# Altium schematic sheet LVDS.SchDoc
size 594 x 420 mm; SheetNumber: 9; SheetTotal: 13
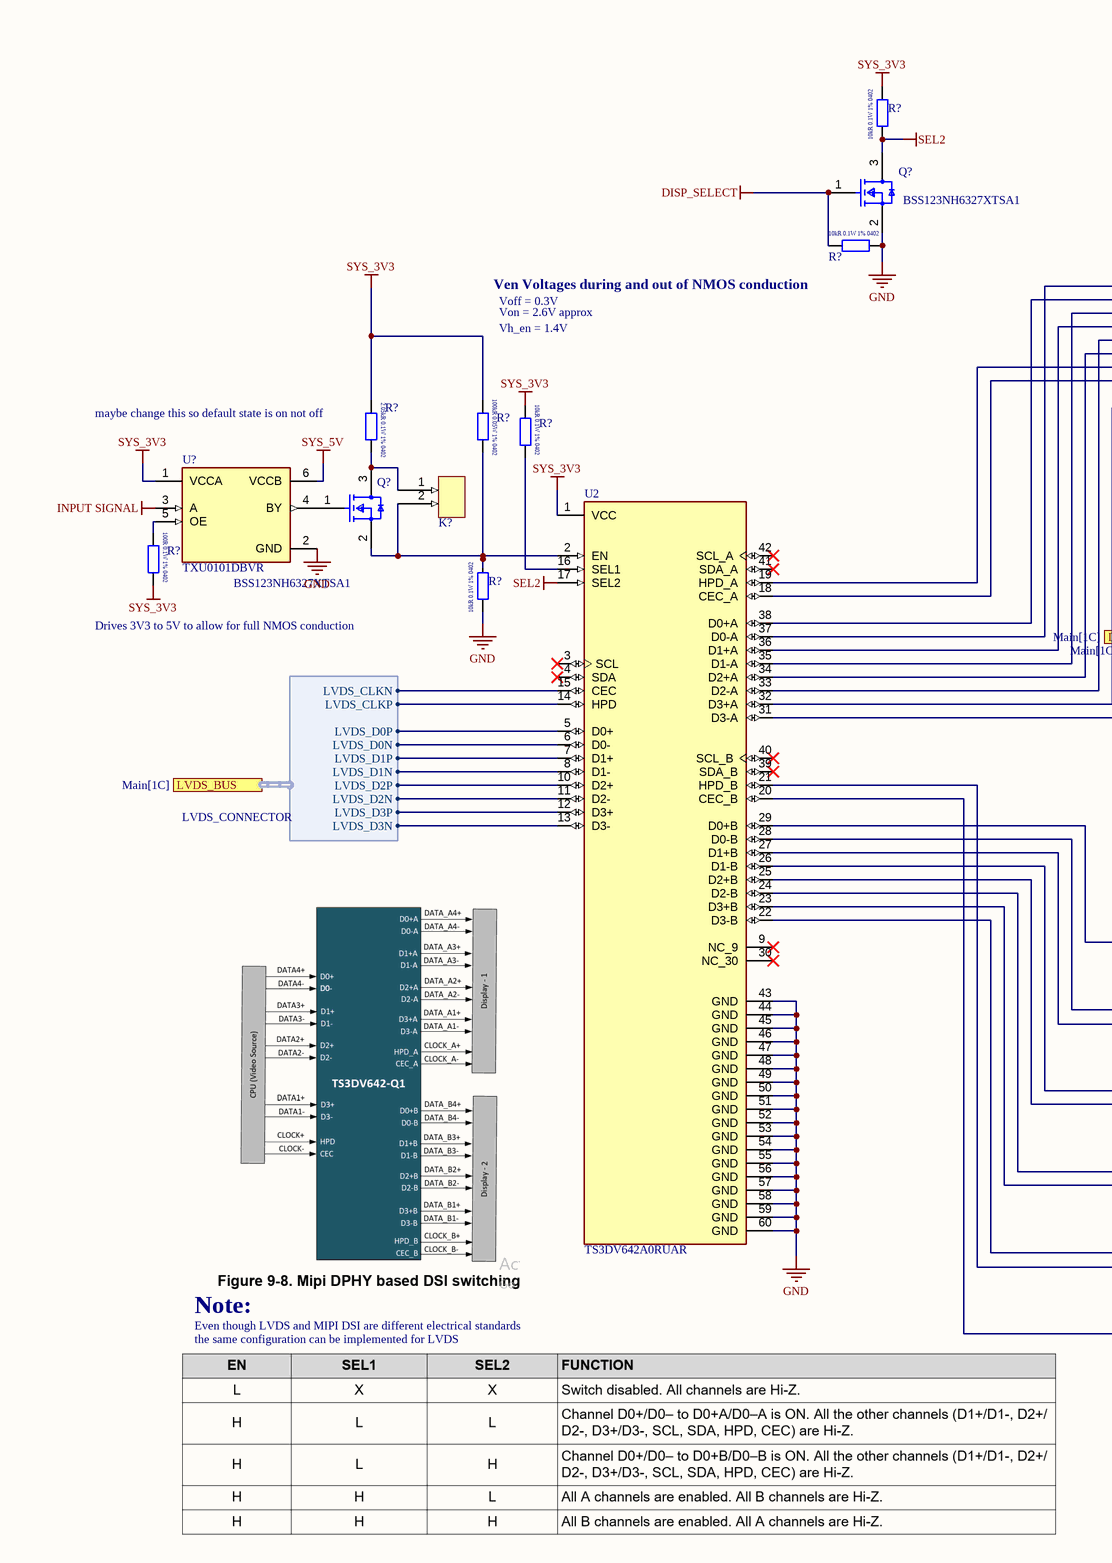
[diagram p0: LVDS.SchDoc, top left]
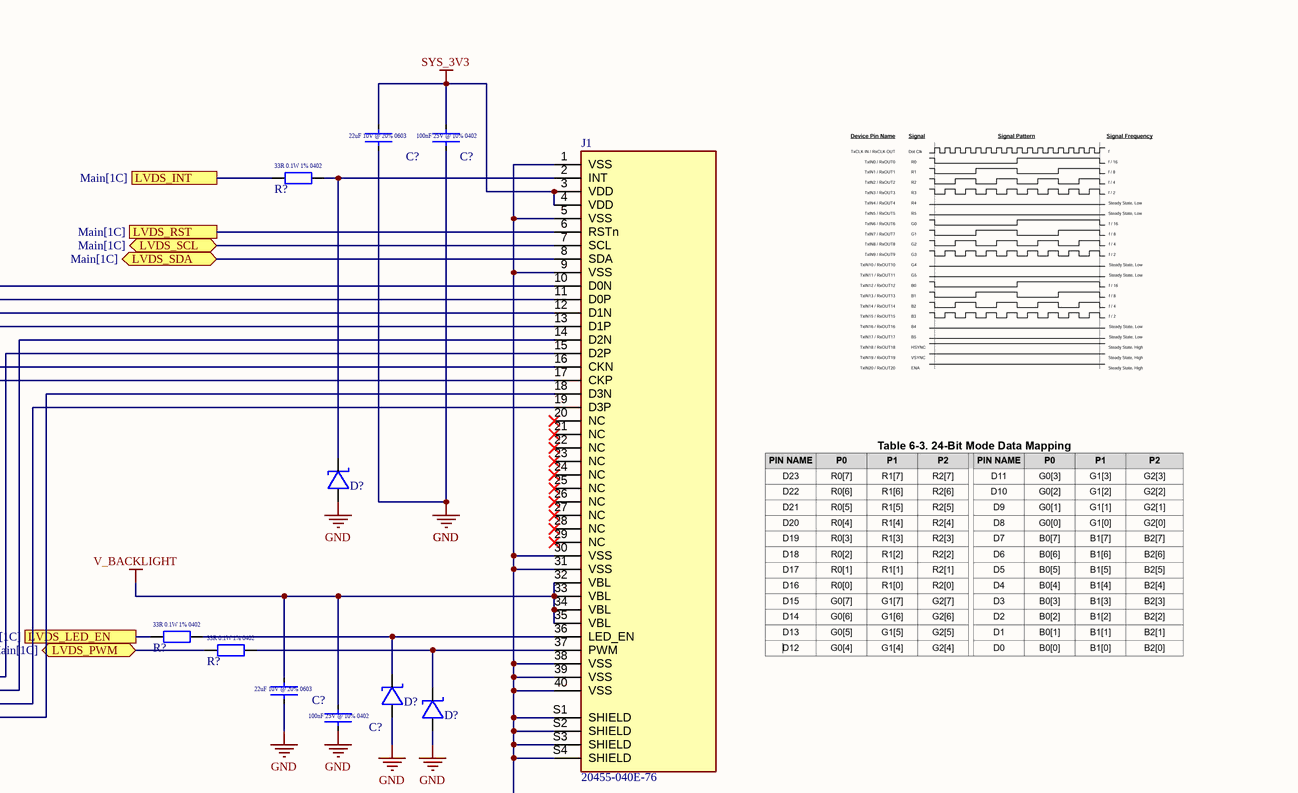
[diagram p1: LVDS.SchDoc, top right]
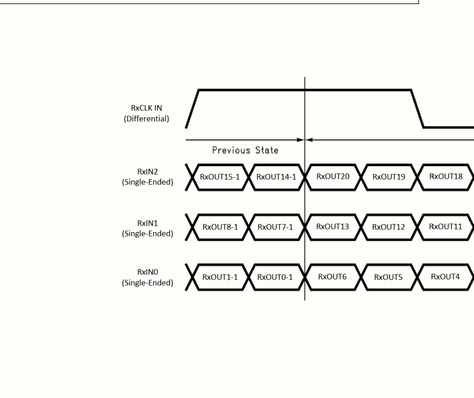
[diagram p2: LVDS.SchDoc, bottom left]
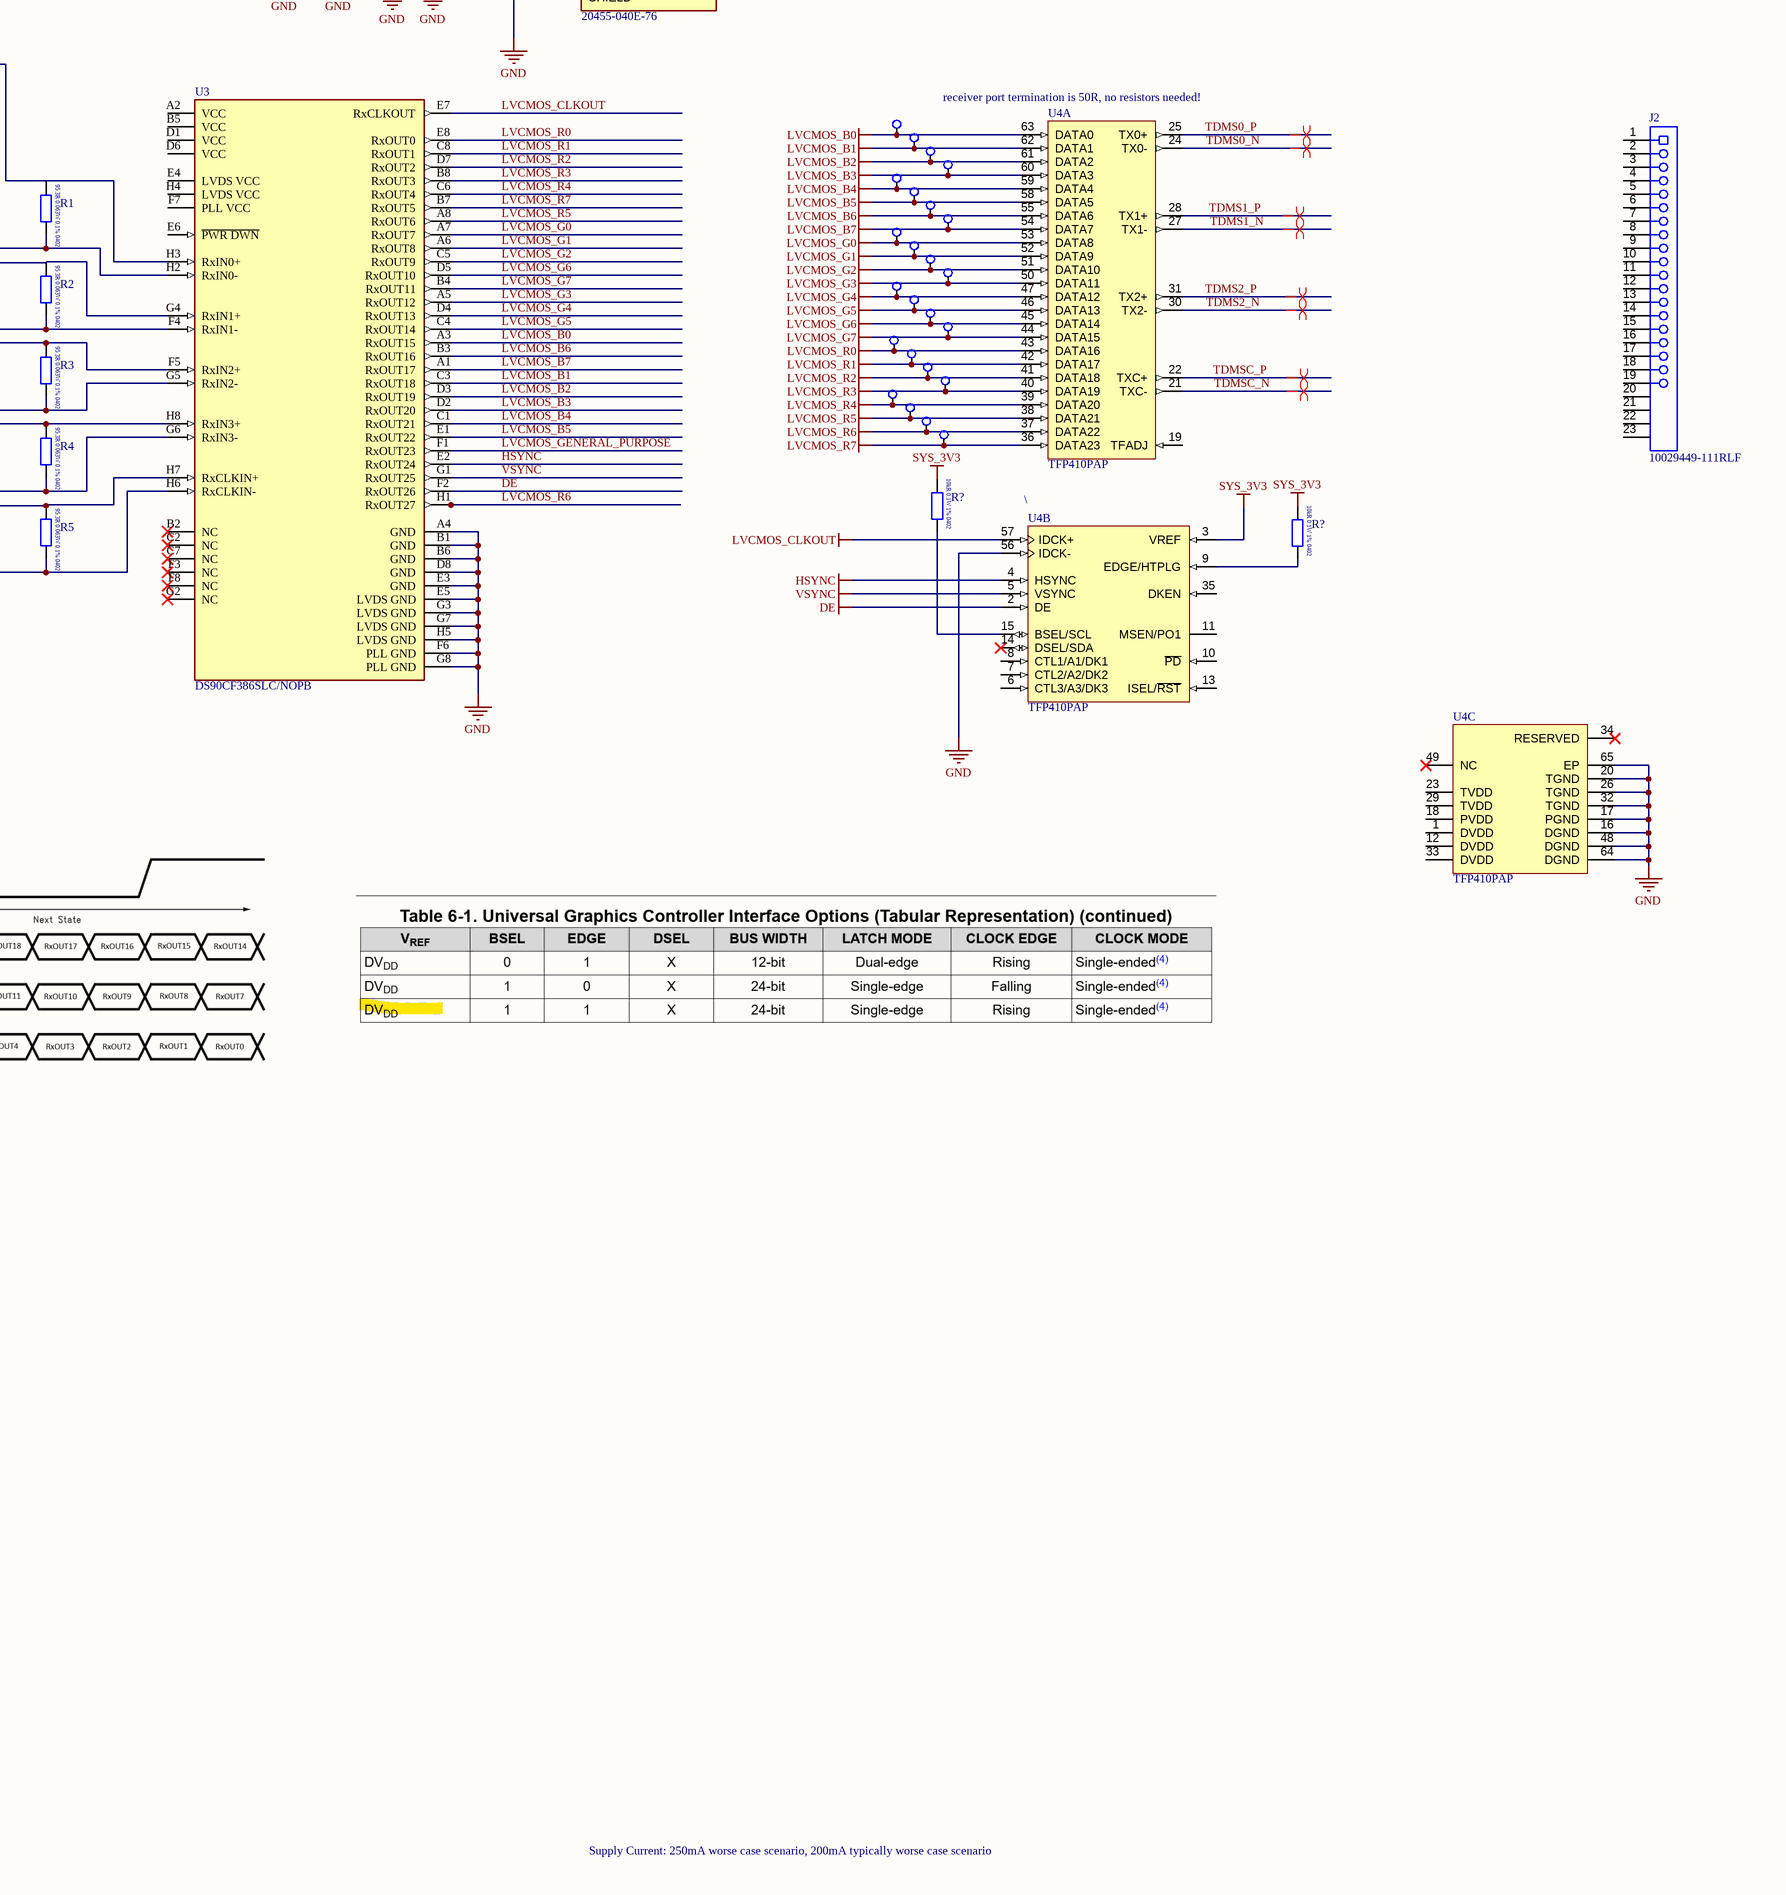
[diagram p3: LVDS.SchDoc, bottom right]

## Parts
(Parts that share a designator on the sheet are numbered #1, #2 ... from top to bottom, then left to right.)
C?#1  CL10A226MP8NUNE  [CAPC1608X09N]  (value not drawn)
C?#2  CL05A104KA5NNNC  [CAPC1005X06N]  (value not drawn)
C?#3  CL10A226MP8NUNE  [CAPC1608X09N]  (value not drawn)
C?#4  CL05A104KA5NNNC  [CAPC1005X06N]  (value not drawn)
D?#1  ESD5581N2T5G  [DIODFN100X60X40-2N]  (value not drawn)
D?#2  ESD5581N2T5G  [DIODFN100X60X40-2N]  (value not drawn)
D?#3  ESD5581N2T5G  [DIODFN100X60X40-2N]  (value not drawn)
J1  20455-040E-76  [IPEX_20455-040E-76]
J2  10029449-111RLF  [FCI-10029449-111RLF_V]
K?  TSW-102-07-F-S  [SAMTEC_TSW-102-07-F-S]  (value not drawn)
Q?#1  BSS123NH6327XTSA1  [FP-PG-SOT23-3-MFG]
Q?#2  BSS123NH6327XTSA1  [FP-PG-SOT23-3-MFG]
R1  ERA-2AEB95R3X  [RESC1005X04L]  (value not drawn)
R2  ERA-2AEB95R3X  [RESC1005X04L]  (value not drawn)
R3  ERA-2AEB95R3X  [RESC1005X04L]  (value not drawn)
R4  ERA-2AEB95R3X  [RESC1005X04L]  (value not drawn)
R5  ERA-2AEB95R3X  [RESC1005X04L]  (value not drawn)
R?#1  RK73H1ETTP1002F  [RESC1005X04N]  (value not drawn)
R?#2  ERJ-2RKF33R0X  [RESC1005X04L]  (value not drawn)
R?#3  RK73H1ETTP1002F  [RESC1005X04N]  (value not drawn)
R?#4  RK73H1ETTP2051F  [RESC1005X04N]  (value not drawn)
R?#5  RK73H1ETTP1003F  [RESC1005X04N]  (value not drawn)
R?#6  RK73H1ETTP1002F  [RESC1005X04N]  (value not drawn)
R?#7  ERJ-2RKF1000X  [RESC1005X04L]  (value not drawn)
R?#8  RK73H1ETTP1002F  [RESC1005X04N]  (value not drawn)
R?#9  ERJ-2RKF33R0X  [RESC1005X04L]  (value not drawn)
R?#10  ERJ-2RKF33R0X  [RESC1005X04L]  (value not drawn)
R?#11  RK73H1ETTP1002F  [RESC1005X04N]  (value not drawn)
R?#12  RK73H1ETTP1002F  [RESC1005X04N]  (value not drawn)
TP  Test Point  [Test Point]  (value not drawn)
TP?#1  Test Point  [Test Point]  (value not drawn)
TP?#2  Test Point  [Test Point]  (value not drawn)
TP?#3  Test Point  [Test Point]  (value not drawn)
TP?#4  Test Point  [Test Point]  (value not drawn)
TP?#5  Test Point  [Test Point]  (value not drawn)
TP?#6  Test Point  [Test Point]  (value not drawn)
TP?#7  Test Point  [Test Point]  (value not drawn)
TP?#8  Test Point  [Test Point]  (value not drawn)
TP?#9  Test Point  [Test Point]  (value not drawn)
TP?#10  Test Point  [Test Point]  (value not drawn)
TP?#11  Test Point  [Test Point]  (value not drawn)
TP?#12  Test Point  [Test Point]  (value not drawn)
TP?#13  Test Point  [Test Point]  (value not drawn)
TP?#14  Test Point  [Test Point]  (value not drawn)
TP?#15  Test Point  [Test Point]  (value not drawn)
TP?#16  Test Point  [Test Point]  (value not drawn)
TP?#17  Test Point  [Test Point]  (value not drawn)
TP?#18  Test Point  [Test Point]  (value not drawn)
TP?#19  Test Point  [Test Point]  (value not drawn)
TP?#20  Test Point  [Test Point]  (value not drawn)
TP?#21  Test Point  [Test Point]  (value not drawn)
TP?#22  Test Point  [Test Point]  (value not drawn)
TP?#23  Test Point  [Test Point]  (value not drawn)
U2  TS3DV642A0RUAR  [QFN50P900X350X80-43N]
U3  DS90CF386SLC/NOPB  [FP-NZC0064A-MFG]
U4  TFP410PAP  [PAP0064D_L]  (parts A,B,C of 3)
U?  TXU0101DBVR  [IC_TXU0101DBVR]

## Ports
LVDS_BUS (harness LVDS_CONNECTOR, see Main[1C]), LVDS_INT (see Main[1C]), LVDS_LED_EN (see Main[1C]), LVDS_PWM (bidir, see Main[1C]), LVDS_RST (see Main[1C]), LVDS_SCL (bidir, see Main[1C]), LVDS_SDA (bidir, see Main[1C])

## Harnesses
LVDS_CONNECTOR: LVDS_D0N, LVDS_D0P, LVDS_D1N, LVDS_D1P, LVDS_D2N, LVDS_D2P, LVDS_CLKN, LVDS_CLKP, LVDS_D3N, LVDS_D3P

## Nets
DE: U3.F2(RxOUT26) U4.2(DE)
DISP_SELECT: Q?#1.1(G) R?#3.1
GND: C?#1.1 C?#2.1 C?#3.1 C?#4.1 D?#1.1 D?#2.1 D?#3.1 J1.1(VSS) J1.5(VSS) J1.9(VSS) J1.30(VSS) J1.31(VSS) J1.38(VSS) J1.39(VSS) J1.40(VSS) J1.S1(SHIELD) J1.S2(SHIELD) J1.S3(SHIELD) J1.S4(SHIELD) Q?#1.2(S) R?#3.2 R?#8.1 U2.43(GND) U2.44(GND) U2.45(GND) U2.46(GND) U2.47(GND) U2.48(GND) U2.49(GND) U2.50(GND) U2.51(GND) U2.52(GND) U2.53(GND) U2.54(GND) U2.55(GND) U2.56(GND) U2.57(GND) U2.58(GND) U2.59(GND) U2.60(GND) U3.A4(GND) U3.B1(GND) U3.B6(GND) U3.D8(GND) U3.E3(GND) U3.E5(LVDS_GND) U3.F6(PLL_GND) U3.G3(LVDS_GND) U3.G7(LVDS_GND) U3.G8(PLL_GND) U3.H5(LVDS_GND) U4.16(DGND) U4.17(PGND) U4.20(TGND) U4.26(TGND) U4.32(TGND) U4.48(DGND) U4.56(IDCK-) U4.64(DGND) U4.65(EP) U?.2(GND)
HSYNC: U3.E2(RxOUT24) U4.4(HSYNC)
INPUT SIGNAL: U?.3(A)
LVCMOS_B0: TP.12 U3.A3(RxOUT15) U4.63(DATA0)
LVCMOS_B1: TP?#1.12 U3.C3(RxOUT18) U4.62(DATA1)
LVCMOS_B2: TP?#2.12 U3.D3(RxOUT19) U4.61(DATA2)
LVCMOS_B3: TP?#3.12 U3.D2(RxOUT20) U4.60(DATA3)
LVCMOS_B4: TP?#4.12 U3.C1(RxOUT21) U4.59(DATA4)
LVCMOS_B5: TP?#5.12 U3.E1(RxOUT22) U4.58(DATA5)
LVCMOS_B6: TP?#6.12 U3.B3(RxOUT16) U4.55(DATA6)
LVCMOS_B7: TP?#7.12 U3.A1(RxOUT17) U4.54(DATA7)
LVCMOS_CLKOUT: U3.E7(RxCLKOUT) U4.57(IDCK+)
LVCMOS_G0: TP?#8.12 U3.A7(RxOUT7) U4.53(DATA8)
LVCMOS_G1: TP?#9.12 U3.A6(RxOUT8) U4.52(DATA9)
LVCMOS_G2: TP?#10.12 U3.C5(RxOUT9) U4.51(DATA10)
LVCMOS_G3: TP?#11.12 U3.A5(RxOUT12) U4.50(DATA11)
LVCMOS_G4: TP?#12.12 U3.D4(RxOUT13) U4.47(DATA12)
LVCMOS_G5: TP?#13.12 U3.C4(RxOUT14) U4.46(DATA13)
LVCMOS_G6: TP?#14.12 U3.D5(RxOUT10) U4.45(DATA14)
LVCMOS_G7: TP?#15.12 U3.B4(RxOUT11) U4.44(DATA15)
LVCMOS_R0: TP?#16.12 U3.E8(RxOUT0) U4.43(DATA16)
LVCMOS_R1: TP?#17.12 U3.C8(RxOUT1) U4.42(DATA17)
LVCMOS_R2: TP?#18.12 U3.D7(RxOUT2) U4.41(DATA18)
LVCMOS_R3: TP?#19.12 U3.B8(RxOUT3) U4.40(DATA19)
LVCMOS_R4: TP?#20.12 U3.C6(RxOUT4) U4.39(DATA20)
LVCMOS_R5: TP?#21.12 U3.A8(RxOUT6) U4.38(DATA21)
LVCMOS_R6: TP?#22.12 U3.H1(RxOUT27) U4.37(DATA22)
LVCMOS_R7: TP?#23.12 U3.B7(RxOUT5) U4.36(DATA23)
SEL2: Q?#1.3(D) R?#1.1 U2.17(SEL2)
SYS_3V3: C?#1.2 C?#2.2 J1.3(VDD) J1.4(VDD) R?#1.2 R?#4.1 R?#5.1 R?#6.1 R?#7.2 R?#11.1 R?#12.1 U2.1(VCC) U4.3(VREF) U?.1(VCCA)
SYS_5V: U?.6(VCCB)
V_BACKLIGHT: C?#3.2 C?#4.2 J1.32(VBL) J1.33(VBL) J1.34(VBL) J1.35(VBL)
VSYNC: U3.G1(RxOUT25) U4.5(VSYNC)
LVCMOS_GENERAL_PURPOSE: U3.F1(RxOUT23)
LVDS_INT: R?#2.1 ; port LVDS_INT
LVDS_LED_EN: R?#9.1 ; port LVDS_LED_EN
LVDS_PWM: R?#10.1 ; port LVDS_PWM
LVDS_RST: J1.6(RSTn) ; port LVDS_RST
LVDS_SCL: J1.7(SCL) ; port LVDS_SCL
LVDS_SDA: J1.8(SDA) ; port LVDS_SDA
TDMS0_N: U4.24(TX0-)
TDMS0_P: U4.25(TX0+)
TDMS1_N: U4.27(TX1-)
TDMS1_P: U4.28(TX1+)
TDMS2_N: U4.30(TX2-)
TDMS2_P: U4.31(TX2+)
TDMSC_N: U4.21(TXC-)
TDMSC_P: U4.22(TXC+)
NetD?#1_2: D?#1.2 J1.2(INT) R?#2.2
NetD?#2_2: D?#2.2 J1.36(LED_EN) R?#9.2
NetD?#3_2: D?#3.2 J1.37(PWM) R?#10.2
NetJ1_10: J1.10(D0N) U2.37(D0-A)
NetJ1_11: J1.11(D0P) U2.38(D0+A)
NetJ1_12: J1.12(D1N) U2.35(D1-A)
NetJ1_13: J1.13(D1P) U2.36(D1+A)
NetJ1_14: J1.14(D2N) U2.33(D2-A)
NetJ1_15: J1.15(D2P) U2.34(D2+A)
NetJ1_16: J1.16(CKN) U2.19(HPD_A)
NetJ1_17: J1.17(CKP) U2.18(CEC_A)
NetJ1_18: J1.18(D3N) U2.31(D3-A)
NetJ1_19: J1.19(D3P) U2.32(D3+A)
NetK?_1: K?.1 Q?#2.3(D) R?#4.2
NetK?_2: K?.2 Q?#2.2(S) R?#5.2 R?#8.2 U2.2(EN)
NetQ?#2_1: Q?#2.1(G) U?.4(BY)
NetR1_2: R1.2 U2.28(D0-B) U3.H2(RxIN0-)
NetR2_1: R2.1 U2.27(D1+B)
NetR2_2: R2.2 U2.26(D1-B) U3.F4(RxIN1-)
NetR3_1: R3.1 U2.25(D2+B) U3.F5(RxIN2+)
NetR3_2: R3.2 U2.24(D2-B) U3.G5(RxIN2-)
NetR4_1: R4.1 U2.23(D3+B) U3.H8(RxIN3+)
NetR4_2: R4.2 U2.22(D3-B) U3.G6(RxIN3-)
NetR5_1: R5.1 U2.21(HPD_B) U3.H7(RxCLKIN+)
NetR5_2: R5.2 U2.20(CEC_B) U3.H6(RxCLKIN-)
NetR?#6_2: R?#6.2 U2.16(SEL1)
NetR?#7_1: R?#7.1 U?.5(OE)
NetR?#11_2: R?#11.2 U4.15(BSEL/SCL)
NetR?#12_2: R?#12.2 U4.9(EDGE/HTPLG)
NetU2_5: U2.5(D0+) ; port LVDS_BUS.LVDS_D0P
NetU2_6: U2.6(D0-) ; port LVDS_BUS.LVDS_D0N
NetU2_7: U2.7(D1+) ; port LVDS_BUS.LVDS_D1P
NetU2_8: U2.8(D1-) ; port LVDS_BUS.LVDS_D1N
NetU2_10: U2.10(D2+) ; port LVDS_BUS.LVDS_D2P
NetU2_11: U2.11(D2-) ; port LVDS_BUS.LVDS_D2N
NetU2_12: U2.12(D3+) ; port LVDS_BUS.LVDS_D3P
NetU2_13: U2.13(D3-) ; port LVDS_BUS.LVDS_D3N
NetU2_14: U2.14(HPD) ; port LVDS_BUS.LVDS_CLKP
NetU2_15: U2.15(CEC) ; port LVDS_BUS.LVDS_CLKN
NetU2_29: U2.29(D0+B) U3.H3(RxIN0+)

Not connected (* = marked no-connect by the designer): J1 20(NC)* 21(NC)* 22(NC)* 23(NC)* 24(NC)* 25(NC)* 26(NC)* 27(NC)* 28(NC)* 29(NC)*; J2 1 2 3 4 5 6 7 8 9 10 11 12 13 14 15 16 17 18 19 20(SHLD1) 21(SHLD2) 22(SHLD3) 23(SHLD4); R1 1; U2 3(SCL)* 4(SDA)* 9(NC_9)* 30(NC_30)* 39(SDA_B)* 40(SCL_B)* 41(SDA_A)* 42(SCL_A)*; U3 A2(VCC) B2(NC)* B5(VCC) C2(NC)* C7(NC)* D1(VCC) D6(VCC) E4(LVDS_VCC) E6(~{PWR_DWN}) F3(NC)* F7(PLL_VCC) F8(NC)* G2(NC)* G4(RxIN1+) H4(LVDS_VCC); U4 1(DVDD) 6(CTL3/A3/DK3) 7(CTL2/A2/DK2) 8(CTL1/A1/DK1) 10(~{PD}) 11(MSEN/PO1) 12(DVDD) 13(ISEL/~{RST}) 14(DSEL/SDA)* 18(PVDD) 19(TFADJ) 23(TVDD) 29(TVDD) 33(DVDD) 34(RESERVED)* 35(DKEN) 49(NC)*

## Layout directives
differential pair: TDMS0_N, TDMS0_P, TDMS1_N, TDMS1_P, TDMS2_N, TDMS2_P, TDMSC_N, TDMSC_P

## Notes on the sheet
- (near R?#3) Ven Voltages during and out of NMOS conduction
- Vh_en = 1.4V
- Voff = 0.3V
- Von = 2.6V approx
- (near R?#4) maybe change this so default state is on not off
- Drives 3V3 to 5V to allow for full NMOS conduction
- receiver port termination is 50R, no resistors needed!
- (near U4) \
- Note:
- Even though LVDS and MIPI DSI are different electrical standards
- the same configuration can be implemented for LVDS
- Supply Current: 250mA worse case scenario, 200mA typically worse case scenario
- DWG NO:
- REV:
- THIS DOCUMENT AND THE DATA DISCLOSED HEREIN OR
- HEREWITH IS THE PROPERTY OF ALTIUM LIMITED AND MAY
- BE FREELY DISTRIBUTED IN WHOLE. NO RIGHTS ARE
- RESERVED OR EXPRESS OR IMPLIED WARANTEE GIVEN.
- REVISION
- DESCRIPTION
- DATE
- APPROVED
- ENG:
- APPROVALS
- PROJECT
- DSN:
- CHK:
- REFERENCE DOCUMENTS
- PROJECT REVISION:
- TITLE
- DOCUMENT REVISION:
- DESIGN ITEM:
- BOM:
- FAB DWG:
- PCB DWG:
- ASSY DWG:
- SCALE:
- A2
- SIZE
- CAGE CODE
- FILE NAME
- DWG NO.
- SHEET
- OF
- REV
- (in symbol CL05A104KA5NNNC) 100nF 25V @ 10% 0402
- (in symbol CL10A226MP8NUNE) 22uF 10V @ 20% 0603
- (in symbol ERA-2AEB95R3X) 95.3R 0.063W 0.1% 0402
- (in symbol ERJ-2RKF33R0X) 33R 0.1W 1% 0402
- (in symbol ERJ-2RKF1000X) 100R 0.1W 1% 0402
- (in symbol RK73H1ETTP1002F) 10kR 0.1W 1% 0402
- (in symbol RK73H1ETTP1003F) 100kR 0.05W 1% 0402
- (in symbol RK73H1ETTP2051F) 2.05kR 0.1W 1% 0402

## Library data of the parts
C?#1 C?#3 = CL10A226MP8NUNE: 22 µF ±20% 10V Ceramic Capacitor X5R 0603 (1608 Metric)
C?#2 C?#4 = CL05A104KA5NNNC: 0.1 µF ±10% 25V Ceramic Capacitor X5R 0402 (1005 Metric)
D?#1-D?#3 = ESD5581N2T5G: 12V Clamp 6A (8/20µs) Ipp Tvs Diode Surface Mount 2-X2DFN (1x0.6)
J1 = 20455-040E-76: N/A; Package: None; Price: None; Value: *; MP: 20455-040E-76; Availability: Unavailable
J2 = CMP-2000-05117-1: Surface Mount Type A HDMI Receptacle without Flange, 19 Positions, 0.5 mm Pitch, -55 to 85 degC, RoHS, Tape and Reel; Manufacturer: FCI; Gender: Female; Number of Positions / Contacts: 19; Contact Rating: 0.5A; Voltage Rating: 40V; Insulation Resistance: 100MOhms; RoHS: Details; Datasheet URL: https://datasheet.ciiva.com/851/10029449-851120.pdf; Termination Style: SMD; Contact Plating: Gold; Housing Material: Resin; Product Type: HDMI; Color: Black; Number of Positions: 19; Mounting Style: SMD/SMT; Packaging: Reel; Brand: FCI; Manufacturer URL: http://www.fci.com/; Contact Material: CopperAlloy; Orientation: Horizontal; Factory Pack Quantity: 400; Operating Temperature Range: -55Cto+85C; Product Category: HDMI,Displayport&DVIConnectors; Datasheet Version: Rev. S, 06/2012
K? = TSW-102-07-F-S: Connector Header Through Hole 2 position 0.100" (2.54mm)
Q?#1 Q?#2 = CMP-32901-000006-1: MOSFET N-CH 100V 0.19A SOT-23; Manufacturer: Infineon; Rthja Max: 250K/W; Number Of Channels: 1; Typ Forward Diode Voltage: 0.8V; Drain To Source Resistance: 2.4Ω; Transconductance: 0.41S; Gate Charge At Vgs: 0.6nC @ 10V; Turn Off Delay Time: 7.4ns; Depletion Mode: False; Input Capacitace At Vds: 15.7pF @ 25V; Max Junction Temp: +150°C; Max Forward Diode Voltage: 1.1V; Power Dissipation: 0.5W; Gate To Source Voltage: 20V; Reverse Recovery Time: 12ns; Turn On Delay Time: 2.3ns; Reverse Recovery Charge: 4.3nC; Pulse Drain Current: 0.77A; Automotive Grade: Grade 0; Threshold Vgs Max: 1.8V; Octopart: https://octopart.com/bss123nh6327xtsa1-infineon-24621685; Category: Trans; Device Class L1: Discrete Semiconductors; Footprint Url: https://www.infineon.com/cms/en/product/packages/PG-SOT23/PG-SOT23-3-5/; Device Class L3: MOSFETs; Height: 1.1mm; ComponentLink2Description: Datasheet; Continuous Drain Current: 0.19A; Automotive: Yes; Device Class L2: Transistors; Lead Free: Yes; Threshold Vgs Min: 0.8V; Drain To Source Breakdown Voltage: 100V; Temperature Range Low: -55°C; Drain To Source Voltage: 100V; Digikey Description: MOSFET N-CH 100V 0.19A SOT-23; Manufacturer Part Number: BSS123NH6327XTSA1; Number Of N Channels: 1; ComponentLink2URL: https://www.infineon.com/dgdl/Infineon-BSS123N-DS-v02_03-en.pdf?fileId=db3a304335f1f4b6013639adfaaa1631; RoHS: TRUE; Mouser Description: Single N-Channel 100V 6 Ohm 0.6 nC OptiMOS? Small Signal Mosfet - SOT-23; Temperature Range High: +150°C; Package: PG-SOT23-3; Temperature: -55°C to +150°C
R1-R5 = ERA-2AEB95R3X: 95.3 Ohms ±0.1% 0.063W, 1/16W Chip Resistor 0402 (1005 Metric) Automotive AEC-Q200 Thin Film
R?#1 R?#3 R?#6 R?#8 R?#11 R?#12 = RK73H1ETTP1002F: 10 kOhms ±1% 0.1W, 1/10W Chip Resistor 0402 (1005 Metric) Automotive AEC-Q200 Thick Film
R?#2 R?#9 R?#10 = ERJ-2RKF33R0X: 33 Ohms ±1% 0.1W, 1/10W Chip Resistor 0402 (1005 Metric) Automotive AEC-Q200 Thick Film
R?#4 = RK73H1ETTP2051F: 2.05 kOhms ±1% 0.1W, 1/10W Chip Resistor 0402 (1005 Metric) Automotive AEC-Q200 Thick Film; Supplier 1: DigiKey; Supplier Part Number 1: 2019-RK73H1ETTP2051FCT-ND
R?#5 = RK73H1ETTP1003F: 100 kOhms ±1% 0.1W, 1/10W Chip Resistor 0402 (1005 Metric) Automotive AEC-Q200 Thick Film
R?#7 = ERJ-2RKF1000X: 100 Ohms ±1% 0.1W, 1/10W Chip Resistor 0402 (1005 Metric) Automotive AEC-Q200 Thick Film; ComponentLink1Description: New link; ComponentLink1URL: https://www.digikey.com.au/en/products/detail/panasonic-electronic-components/ERJ-2RKF1000X/192080; Supplier 1: Mouser; Supplier Part Number 1: 667-ERJ-2RKF1000X
U2 = TS3DV642A0RUAR: Multi-Channel Differential Switch/Multiplexer Targeting DVI/HDMI & DisplayPort Applications 42-WQFN -40 to 85; MF: Texas Instruments; Texas_Instruments-Purchase-URL: https://snapeda.com/shop?store=Texas+Instruments&id=50654; SnapEDA_Link: https://www.snapeda.com/parts/TS3DV642A0RUAR/Texas%20Instruments/view-part/50654/?ref=snap; Price: None; Availability: Unavailable; Value: *; MP: TS3DV642A0RUAR; Package: WQFN-42 Texas Instruments; Check_prices: https://www.snapeda.com/parts/TS3DV642A0RUAR/Texas%20Instruments/view-part/50654/?ref=eda; Supplier 1: DigiKey; Supplier Part Number 1: 296-TS3DV642RUARQ1CT-ND
U3 = CMP-04872-000045-1: IC INTFACE SPECIALIZED 64NFBGA; Max Power Dissipation: 1.61W; Number of Elements: 3; Data Rate: 2380Mbps; Logic Function: Receiver; Number of Drivers: 28; Max Supply Voltage: 3.6V; Min Supply Voltage: 3V; Operating Supply Voltage: 3.3V; Power Dissipation: 1.61W; Series: DS90CF386; Min Operating Temperature: -10°C; Mount: Surface Mount; Case/Package: FBGA; Radiation Hardening: No; Lead Free: Lead Free; Packaging: Tray; Package Quantity: 360; Number of Receivers: 3; Number of Pins: 64; Max Operating Temperature: 70°C
U4 = CMP-0325-00079-3: PanelBus DVI Transmitter 165 MHz with 3 Data Channels, 3.3 V, 0 to +70 degC, 64-pin HTQFP (PAP), Green (RoHS & no Sb/Br); Manufacturer: Texas Instruments; Serial Data Transmitter Channels: 3; SubFamily: PanelBus (DVI); PLL Frequency(MHz): 25 to 165; Supply Voltage(s)(V): 3.3; Rating: Catalog; Transmitter: TRUE; Number of Parallel Inputs: 24; Eco-Plan: Green (RoHS & no Sb/Br); DatasheetVersion: SLDS145B; PackageDescription: 64-Pin Plastic Quad Flat Pack, 10 x 10 mm Body, 0.5 mm Pitch, Exposed Pad; PackageVersion: revC, Aug-2003; ComponentLink3Description: URL Link1; ComponentLink3URL: SamplesURL:http://www.ti.com/product/tfp410#samples; ComponentLink2Description: Datasheet; ComponentLink2URL: http://www.ti.com/general/docs/lit/getliterature.tsp?genericPartNumber=TFP410&fileType=pdf; ComponentLink1Description: Manufacturer URL; PackageReference: PAP0064D; Mounting Technology: Surface Mount; ComponentLink1URL: http://www.ti.com/; PartNumber: TFP410PAP
U? = TXU0101DBVR: Voltage Level Translator Unidirectional 1 Circuit 1 Channel 200Mbps SOT-23-6; MF: Texas Instruments; SnapEDA_Link: https://www.snapeda.com/parts/TXU0101DBVR/Texas+Instruments/view-part/?ref=snap; Package: None; Value: *; MP: TXU0101DBVR; Check_prices: https://www.snapeda.com/parts/TXU0101DBVR/Texas+Instruments/view-part/?ref=eda